# EAGLE design Shield (EAGLE 8.3.2)
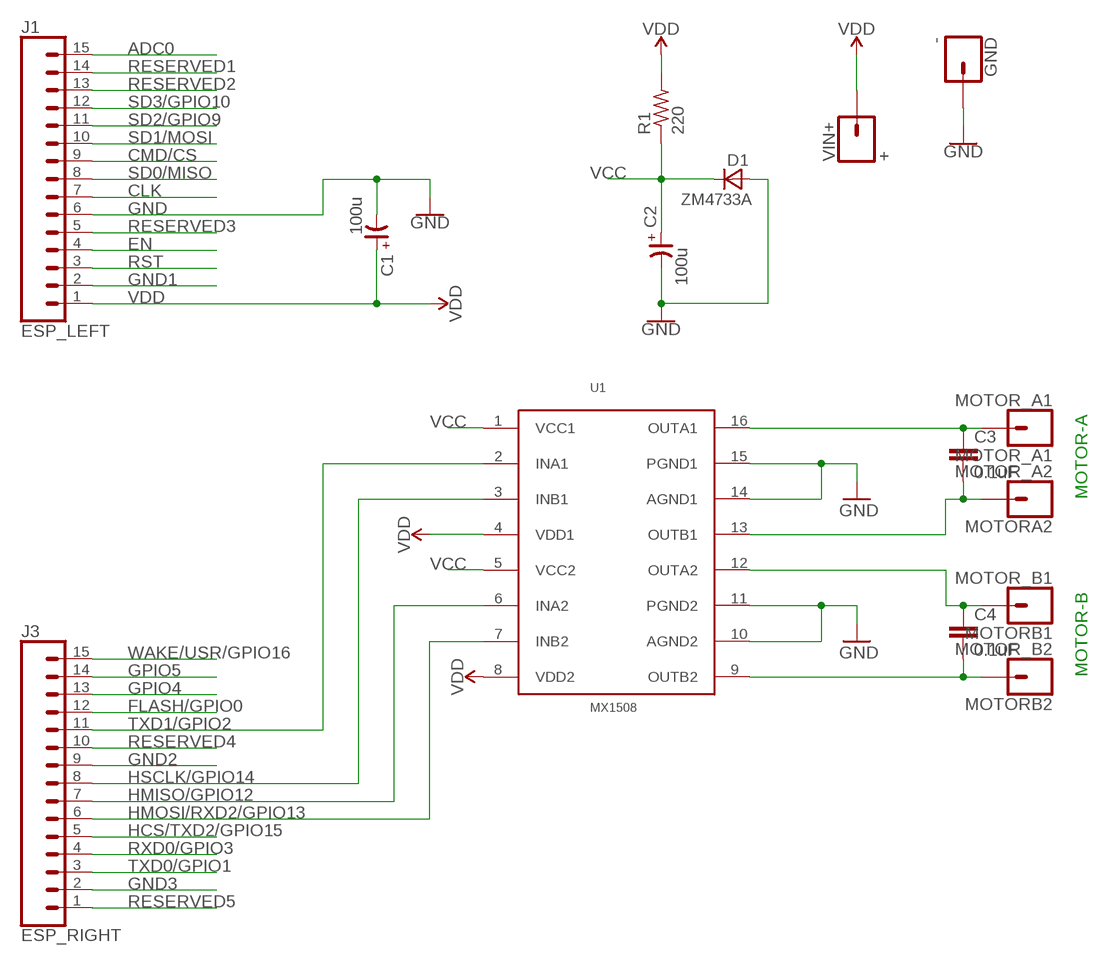
[diagram p0: schematic, sheet 1]

## Parts
C1  100u  CP-SV-D  [SV-D]
C2  100u  CP-SV-D  [SV-D]
C3  0.1uF  0.1UF-KIT-EZ-50V-20%  [CAP-PTH-SMALL-KIT]
C4  0.1uF  0.1UF-KIT-EZ-50V-20%  [CAP-PTH-SMALL-KIT]
D1  ZM4733A  SM400GENERIC  [MELF-MLL41]
GND  -  CONN_01  [1X01]
J1  ESP_LEFT  CONN_15  [1X15]
J3  ESP_RIGHT  CONN_15  [1X15]
MOTOR_A1  MOTOR_A1  CONN_01  [1X01]
MOTORA2  MOTOR_A2  CONN_01  [1X01]
MOTORB1  MOTOR_B1  CONN_01  [1X01]
MOTORB2  MOTOR_B2  CONN_01  [1X01]
R1  220  R-US_R2512  [R2512]
U1  MX1508  [MX1508]
VIN+  +  CONN_01  [1X01]

## Nets
ADC0: J1.15
CLK: J1.7
CMD/CS: J1.9
EN: J1.4
FLASH/GPIO0: J3.12
GND: C1.- C2.- D1.A GND.1 J1.6 U1.10(AGND2) U1.11(PGND2) U1.14(AGND1) U1.15(PGND1)
GND1: J1.2
GND2: J3.9
GND3: J3.2
GPIO4: J3.13
GPIO5: J3.14
HCS/TXD2/GPIO15: J3.5
HMISO/GPIO12: J3.7 U1.6(INA2)
HMOSI/RXD2/GPIO13: J3.6 U1.7(INB2)
HSCLK/GPIO14: J3.8 U1.3(INB1)
N$1: C3.1 MOTOR_A1.1 U1.16(OUTA1)
N$2: C3.2 MOTORA2.1 U1.13(OUTB1)
N$3: C4.1 MOTORB1.1 U1.12(OUTA2)
N$4: C4.2 MOTORB2.1 U1.9(OUTB2)
RESERVED1: J1.14
RESERVED2: J1.13
RESERVED3: J1.5
RESERVED4: J3.10
RESERVED5: J3.1
RST: J1.3
RXD0/GPIO3: J3.4
SD0/MISO: J1.8
SD1/MOSI: J1.10
SD2/GPIO9: J1.11
SD3/GPIO10: J1.12
TXD0/GPIO1: J3.3
TXD1/GPIO2: J3.11 U1.2(INA1)
VCC: C2.+ D1.C R1.1 U1.1(VCC1) U1.5(VCC2)
VDD: C1.+ J1.1 R1.2 U1.4(VDD1) U1.8(VDD2) VIN+.1
WAKE/USR/GPIO16: J3.15

## Notes on the sheet
- MOTOR-A
- MOTOR-B

## Library data of the parts
C1 C2 = cap-master:CP-: POLARIZED CAP
C3 C4 = SparkFun-Capacitors:0.1UF: 0.1µF ceramic capacitors A capacitor is a passive two-terminal electrical component used to store electrical energy temporarily in an electric field.; PROD_ID: CAP-08370
D1 = _mod_diode:SM400*: SM4001 .. SM4007 General Purpose Rectifier, 1 A SMD-Version of 1N4001 .. 1N4007 Case: MELF-MLL41 = DO 213 AB Author: Dipl.-Ing. FH Rainer Bayer HHN Hochschule Heilbronn, rainer.bayer@hs-heilbronn.de Ingenieurbüro ing-rb, mail@ing-rb.de
GND MOTOR_A1 MOTORA2 MOTORB1 MOTORB2 VIN+ = SparkFun-Connectors:CONN_01: Single connection point. Often used as Generic Header-pin footprint for 0.1 inch spaced/style header connections On any of the 0.1 inch spaced packages, you can populate with these: Break Away Headers - Straight <https://www.sparkfun.com/products/116> (PRT-00116) Break Away Male Headers - Right Angle <https://www.sparkfun.com/products/553> (PRT-00553) Female Headers <https://www.sparkfun.com/products/115> (PRT-00115) Break Away Headers - Machine Pin <https://www.sparkfun.com/products/117> (PRT-00117) Break Away Female Headers - Swiss Machine Pin <https://www.sparkfun.com/products/743> (PRT-00743) This device is also useful as a general connection point to wire up your design to another part of your project. Our various solder wires solder well into these plated through hole pads. Hook-Up Wire - Assortment (Stranded, 22 AWG) <https://www.sparkfun.com/products/11375> (PRT-11375) Hook-Up Wire - Assortment (Solid Core, 22 AWG) <https://www.sparkfun.com/products/11367> (PRT-11367) View the entire wire category on our website here <https://www.sparkfun.com/categories/141> Special notes: SMTSO-256-ET is a "flush mount" nut for a 4-40 screw. We mostly use this on specialty testbeds; it is a nice way to connect hardware to your PCB at an adjustable hieght. Also note, the SNAP packages are for using a snappable style connector. We sell a baggie of snaps and they are also used on two LilyPad designs: Snap Assortment - 30 pack (male and female) <https://www.sparkfun.com/products/11347> (DEV-11347) LilyPad Arduino SimpleSnap <https://www.sparkfun.com/products/10941> (DEV-10941) LilyPad SimpleSnap Protoboard <https://www.sparkfun.com/products/10940> (DEV-10940)
J1 J3 = SparkFun-Connectors:CONN_15: Multi connection point. Often used as Generic Header-pin footprint for 0.1 inch spaced/style header connections On any of the 0.1 inch spaced packages, you can populate with these: Break Away Headers - Straight <https://www.sparkfun.com/products/116> (PRT-00116) Break Away Male Headers - Right Angle <https://www.sparkfun.com/products/553> (PRT-00553) Female Headers <https://www.sparkfun.com/products/115> (PRT-00115) Break Away Headers - Machine Pin <https://www.sparkfun.com/products/117> (PRT-00117) Break Away Female Headers - Swiss Machine Pin <https://www.sparkfun.com/products/743> (PRT-00743) For SCREWTERMINALS and SPRING TERMINALS visit here: Screw Terimnals on SparkFun.com <https://www.sparkfun.com/search/results?term=Screw+Terminals> (5mm/3.5mm/2.54mm spacing) This device is also useful as a general connection point to wire up your design to another part of your project. Our various solder wires solder well into these plated through hole pads. Hook-Up Wire - Assortment (Stranded, 22 AWG) <https://www.sparkfun.com/products/11375> (PRT-11375) Hook-Up Wire - Assortment (Solid Core, 22 AWG) <https://www.sparkfun.com/products/11367> (PRT-11367) View the entire wire category on our website here <https://www.sparkfun.com/categories/141> Special notes: Molex polarized connector foot print use with SKU : PRT-08231 with associated crimp pins and housings. 1MM SMD Version SKU: PRT-10208 NOTES ON THE VARIANTS LOCK and LOCK_LONGPADS... This footprint was designed to help hold the alignment of a through-hole component (i.e. 6-pin header) while soldering it into place. You may notice that each hole has been shifted either up or down by 0.005 of an inch from it's more standard position (which is a perfectly straight line). This slight alteration caused the pins (the squares in the middle) to touch the edges of the holes. Because they are alternating, it causes a "brace" to hold the component in place. 0.005 has proven to be the perfect amount of "off-center" position when using our standard breakaway headers. Although looks a little odd when you look at the bare footprint, once you have a header in there, the alteration is very hard to notice. Also,if you push a header all the way into place, it is covered up entirely on the bottom side.
R1 = resistor:R-US_: RESISTOR, American symbol
U1 = MX:MX1508: MX1508 Dual H-bridge motor driver

## Board
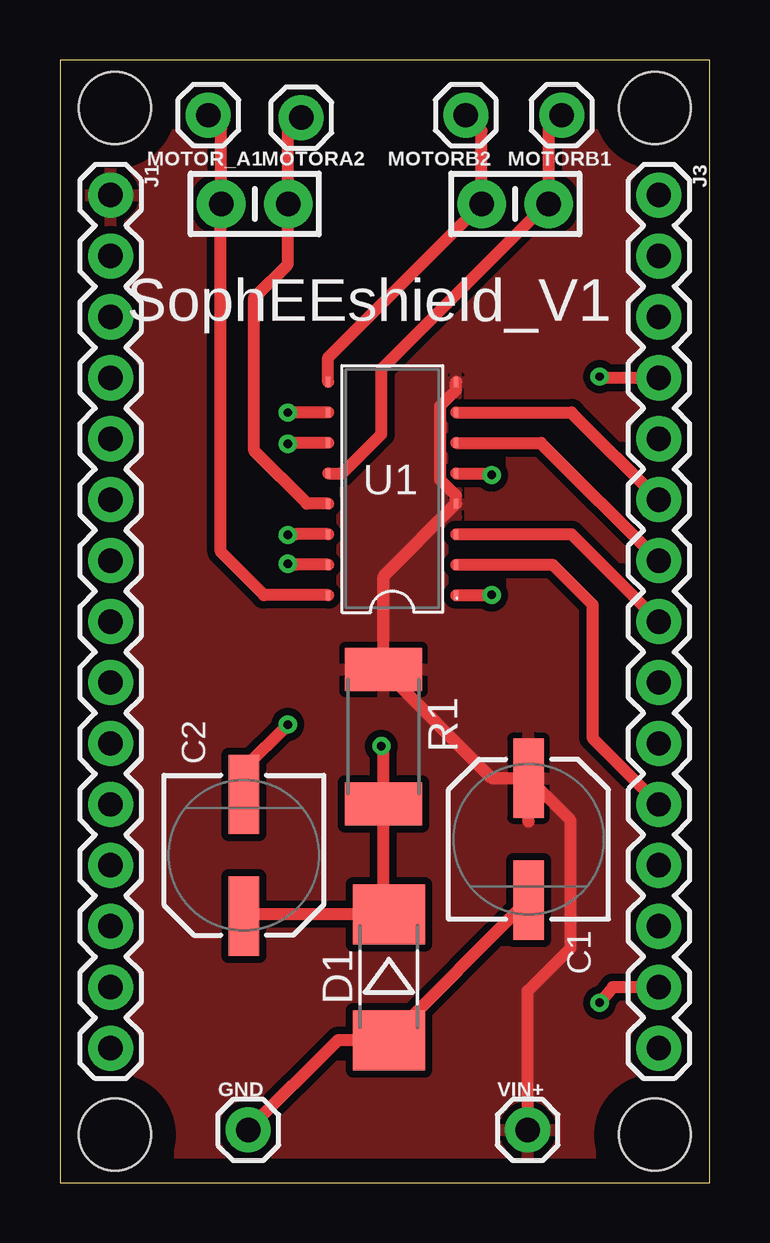
[diagram p1: board, top side]
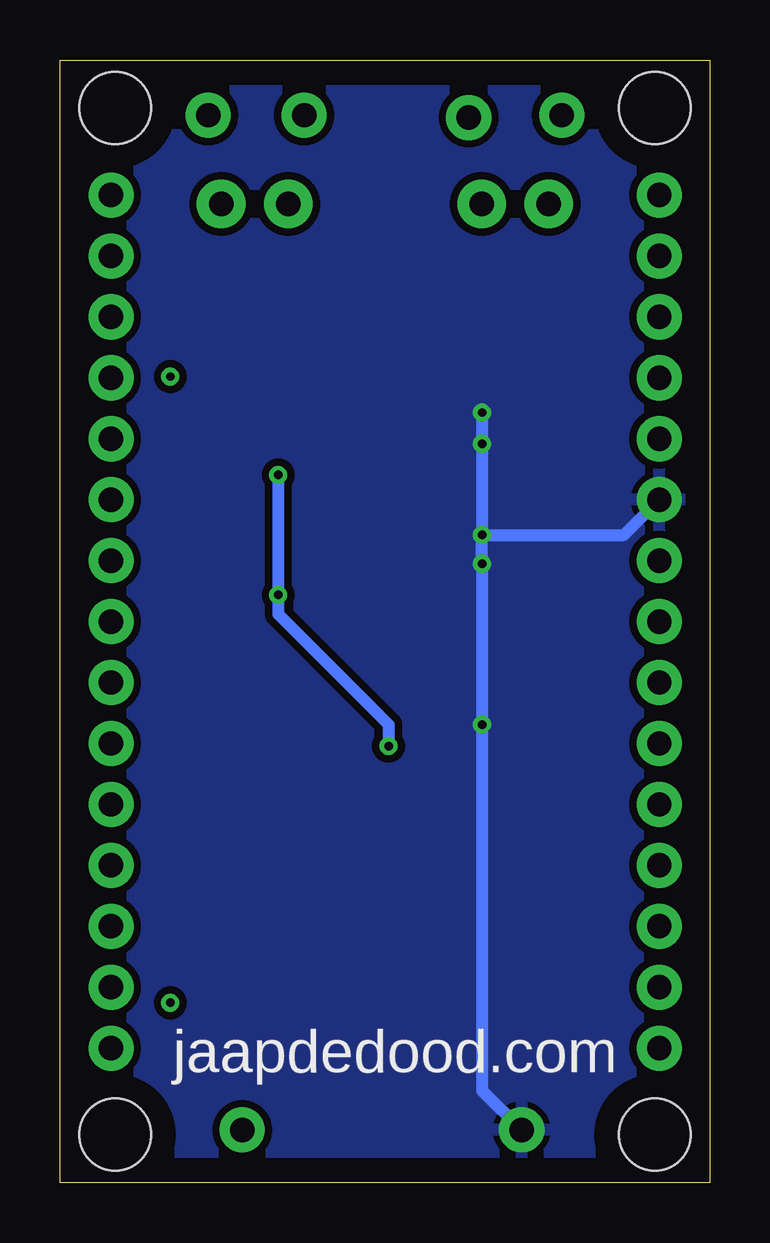
[diagram p2: board, bottom side, seen from below]

Size 27.1 x 46.8 mm. Coordinates in mm from the lower left corner, seen from the top.
Outline: 0,0 27.1,0 27.1,46.8 0,46.8 0,0
Copper layers (1*16): Top 0.035mm / dielectric 1.5mm / Bottom 0.035mm
Design rules "default *": minimum track width 6mil, minimum drill 0.35mm, track to track 6mil, track to pad 6mil, pad to pad 6mil, via to via 6mil, smd to smd 6mil, copper to edge 40mil, drill to drill 6mil, minimum pad ring 10mil, minimum via ring 8mil, stop-mask expansion 4mil, vias tented up to drill 25mil, thermal gap 10mil
Holes 3 mm at 2.3,44.8 24.8,44.8 2.3,2 24.8,2

### Footprints (pad centres in the part's own frame; a part is rotated, then mirrored left to right if it is on the bottom)
SV-D = smd 3.302 x 1.27: + -2.54,0; - 2.54,0
CAP-PTH-SMALL-KIT = drill 1.016 pad 2.032: 1 -1.397,0; 2 1.397,0
MELF-MLL41 = smd 2.5 x 3: A 2.625,0; C -2.625,0
1X01 = drill 1.016 pad 1.88: 1 0,0
1X15 = drill 1.016 pad 1.88: 1 0,0; 2 2.54,0; 3 5.08,0; 4 7.62,0; 5 10.16,0; 6 12.7,0; 7 15.24,0; 8 17.78,0; 9 20.32,0; 10 22.86,0; 11 25.4,0; 12 27.94,0; 13 30.48,0; 14 33.02,0; 15 35.56,0
R2512 = smd 1.8 x 3.2: 1 -2.8,0; 2 2.8,0
MX1508 = smd 0.41 x 0.2: 1 -5.08,-2.67; 2 -3.81,-2.67; 3 -2.54,-2.67; 4 -1.27,-2.67; 5 0,-2.67; 6 1.27,-2.67; 7 2.54,-2.67; 8 3.81,-2.67; 9 3.81,2.67; 10 2.54,2.67; 11 1.27,2.67; 12 0,2.67; 13 -1.27,2.67; 14 -2.54,2.67; 15 -3.81,2.67; 16 -5.08,2.67

### Placement (x,y rotation side)
C1  19.54,14.32 270 top
C2  7.66,13.65 90 top
C3  8.12,40.8 0 top
C4  18.98,40.8 180 top
D1  13.71,8.57 270 top
GND  7.85,2.2 0 top
J1  2.11,41.17 270 top
J3  24.97,41.17 270 top
MOTOR_A1  6.18,44.5 180 top
MOTORA2  10.06,44.4 180 top
MOTORB1  20.92,44.5 180 top
MOTORB2  16.92,44.5 180 top
R1  13.49,18.59 90 top
U1  13.85,29.57 90 top
VIN+  19.5,2.2 0 top

### Tracks (layer width: path | path; a pad name or v marks a point on that pad's centre or on a via)
GND  (via drill 0.35)
  Top 0.508: U1.15 9.84,25.76 v9.5,25.8 | U1.14 9.83,27.03 v9.5,27 | U1.11 9.84,30.84 v9.5,30.8 | U1.10 9.81,32.11 v9.5,32.1 | C1.- D1.A 11.6,5.95 GND.1 | C2.- 7.66,17.26 v9.5,19.1
  Bottom 0.508: v9.5,27 v9.5,25.8 v9.5,19.1 9.5,3.85 GND.1 | v9.5,27 v9.5,30.8 v9.5,32.1 | v9.5,27 3.58,27 J1.6
  pour Bottom (isolate 0.305): 0,0 27.1,0 27.1,46.8 0,46.8
GPIO5  (via drill 0.35)
  Top 0.508: J3.14 23.05,8.15 v22.5,7.5
HMISO/GPIO12
  Top 0.508: U1.6 20.06,30.84 J3.7
HMOSI/RXD2/GPIO13
  Top 0.508: U1.7 21.33,32.11 J3.6
HSCLK/GPIO14
  Top 0.508: U1.3 21.33,27.03 J3.8
N$1
  Top 0.508: MOTOR_A1.1 6.72,43.96 C3.1 6.7,40.78 6.7,26.3 8.51,24.49 U1.16
N$2
  Top 0.508: MOTORA2.1 9.52,43.86 C3.2 9.5,40.78 9.5,38.3 8.1,36.9 8.1,30.5 10.3,28.3 U1.13
N$3
  Top 0.508: 20.38,40.9 C4.1 | 20.38,40.9 20.38,43.96 MOTORB1.1 | U1.12 11.77,29.57 13.4,31.2 13.4,33.92 20.38,40.9
N$4
  Top 0.508: U1.9 11.18,34.4 C4.2 17.58,43.84 MOTORB2.1
RXD0/GPIO3  (via drill 0.35)
  Top 0.508: J3.4 22.55,33.55 v22.5,33.6
TXD1/GPIO2
  Top 0.508: U1.2 20.54,25.76 22.2,24.1 22.2,18.54 J3.11
VCC  (via drill 0.35)
  Top 0.508: C2.+ 7.75,11.2 D1.C 13.49,11.41 R1.1 13.49,18.11 v13.4,18.2 | U1.1 v17.99,24.49 v18,24.5 | U1.5 17.93,29.57 v18,29.5
  Bottom 0.508: v13.4,18.2 13.4,19.1 18,23.7 v18,24.5 v18,29.5
VDD
  Top 0.508: 19.54,15.06 C1.+ | VIN+.1 19.5,8 21.3,9.8 21.3,15.1 C1.+ | C1.+ 18.02,16.86 R1.2 13.49,25.27 U1.4 16.52,28.64 15.86,29.3 15.86,32.38 16.52,33.04 U1.8
  pour Top (isolate 0.305): 0,0 0,46.8 27.1,46.8 27.1,0

### Text on the board
tPlace: SophEEshield_V1
bPlace: jaapdedood.com